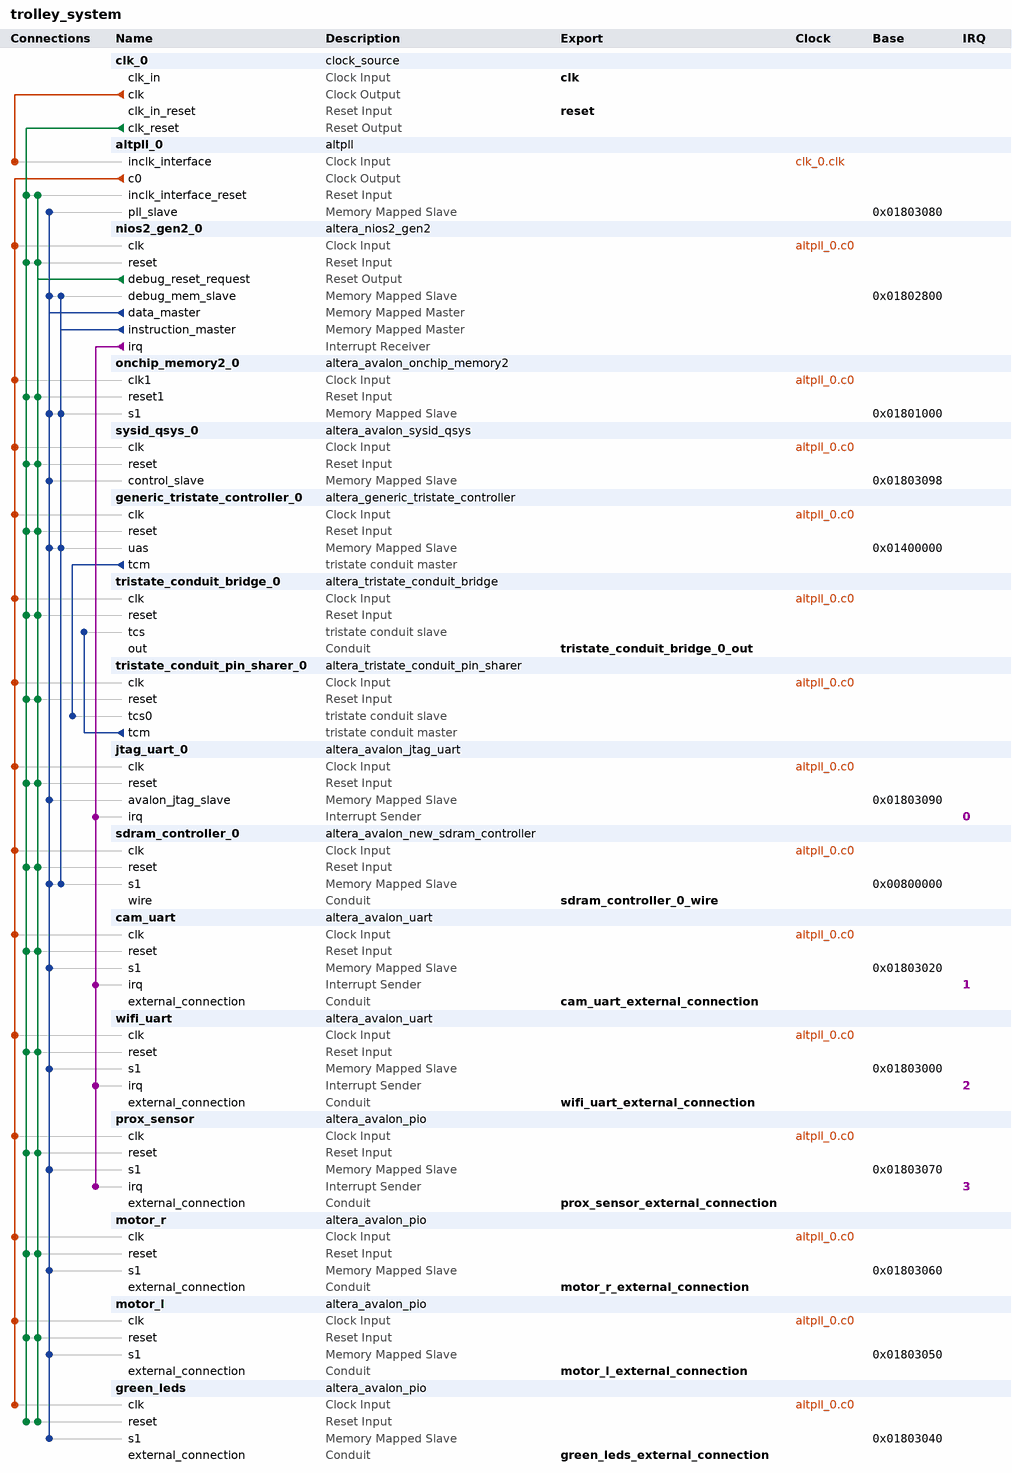
[diagram p0: system contents]
# Platform Designer (Qsys) system trolley_system, Cyclone IV E EP4CE22F17C6
# Parameters at their usual value, and those the tool derives, are not listed.
package require -exact qsys 16.1
create_system trolley_system
set_project_property DEVICE_FAMILY {Cyclone IV E}
set_project_property DEVICE EP4CE22F17C6

add_instance clk_0 clock_source 16.1
set_instance_parameter_value clk_0 clockFrequency 50000000

add_instance altpll_0 altpll 16.1
set_instance_parameter_value altpll_0 CLK0_DIVIDE_BY 1
set_instance_parameter_value altpll_0 CLK0_MULTIPLY_BY 1
set_instance_parameter_value altpll_0 INCLK0_INPUT_FREQUENCY 20000
set_instance_parameter_value altpll_0 PORT_ARESET PORT_UNUSED
set_instance_parameter_value altpll_0 PORT_LOCKED PORT_UNUSED
set_instance_parameter_value altpll_0 PORT_clk1 PORT_UNUSED
set_instance_parameter_value altpll_0 PORT_clk2 PORT_UNUSED
set_instance_parameter_value altpll_0 PORT_clk3 PORT_UNUSED

add_instance nios2_gen2_0 altera_nios2_gen2 16.1
set_instance_parameter_value nios2_gen2_0 dcache_size 2048
set_instance_parameter_value nios2_gen2_0 exceptionSlave onchip_memory2_0.s1
set_instance_parameter_value nios2_gen2_0 icache_size 4096
set_instance_parameter_value nios2_gen2_0 impl Tiny
set_instance_parameter_value nios2_gen2_0 resetSlave generic_tristate_controller_0.uas

add_instance onchip_memory2_0 altera_avalon_onchip_memory2 16.1
set_instance_parameter_value onchip_memory2_0 dataWidth 32
set_instance_parameter_value onchip_memory2_0 dualPort false
set_instance_parameter_value onchip_memory2_0 initMemContent true
set_instance_parameter_value onchip_memory2_0 initializationFileName onchip_mem.hex
set_instance_parameter_value onchip_memory2_0 memorySize 4096

add_instance sysid_qsys_0 altera_avalon_sysid_qsys 16.1
set_instance_parameter_value sysid_qsys_0 id 0

add_instance generic_tristate_controller_0 altera_generic_tristate_controller 16.1
set_instance_parameter_value generic_tristate_controller_0 ACTIVE_LOW_BEGINTRANSFER 0
set_instance_parameter_value generic_tristate_controller_0 ACTIVE_LOW_BYTEENABLE 0
set_instance_parameter_value generic_tristate_controller_0 ACTIVE_LOW_OUTPUTENABLE 0
set_instance_parameter_value generic_tristate_controller_0 ACTIVE_LOW_READ 1
set_instance_parameter_value generic_tristate_controller_0 CHIPSELECT_THROUGH_READLATENCY 0
set_instance_parameter_value generic_tristate_controller_0 INTERFACE_ASSIGNMENT_KEYS embeddedsw.configuration.isFlash,embeddedsw.configuration.isMemoryDevice,embeddedsw.configuration.isNonVolatileStorage
set_instance_parameter_value generic_tristate_controller_0 INTERFACE_ASSIGNMENT_VALUES 1,1,1
set_instance_parameter_value generic_tristate_controller_0 MODULE_ASSIGNMENT_KEYS embeddedsw.configuration.hwClassnameDriverSupportList,embeddedsw.configuration.isFlash,embeddedsw.configuration.isMemoryDevice,embeddedsw.configuration.isNonVolatileStorage
set_instance_parameter_value generic_tristate_controller_0 MODULE_ASSIGNMENT_VALUES "altera_avalon_lan91c111\\,altera_avalon_cfi_flash,1,1,1"
set_instance_parameter_value generic_tristate_controller_0 TCM_ADDRESS_W 22
set_instance_parameter_value generic_tristate_controller_0 TCM_BYTEENABLE_W 1
set_instance_parameter_value generic_tristate_controller_0 TCM_DATA_HOLD 40
set_instance_parameter_value generic_tristate_controller_0 TCM_DATA_W 8
set_instance_parameter_value generic_tristate_controller_0 TCM_MAX_PENDING_READ_TRANSACTIONS 3
set_instance_parameter_value generic_tristate_controller_0 TCM_READLATENCY 2
set_instance_parameter_value generic_tristate_controller_0 TCM_READ_WAIT 160
set_instance_parameter_value generic_tristate_controller_0 TCM_SETUP_WAIT 40
set_instance_parameter_value generic_tristate_controller_0 TCM_SYMBOLS_PER_WORD 1
set_instance_parameter_value generic_tristate_controller_0 TCM_TIMING_UNITS 0
set_instance_parameter_value generic_tristate_controller_0 TCM_TURNAROUND_TIME 2
set_instance_parameter_value generic_tristate_controller_0 TCM_WRITE_WAIT 160
set_instance_parameter_value generic_tristate_controller_0 USE_BEGINTRANSFER 0
set_instance_parameter_value generic_tristate_controller_0 USE_BYTEENABLE 0
set_instance_parameter_value generic_tristate_controller_0 USE_OUTPUTENABLE 0
set_instance_parameter_value generic_tristate_controller_0 USE_READ 1

add_instance tristate_conduit_bridge_0 altera_tristate_conduit_bridge 16.1

add_instance tristate_conduit_pin_sharer_0 altera_tristate_conduit_pin_sharer 16.1
set_instance_parameter_value tristate_conduit_pin_sharer_0 MODULE_ORIGIN_LIST generic_tristate_controller_0.tcm,generic_tristate_controller_0.tcm,generic_tristate_controller_0.tcm,generic_tristate_controller_0.tcm,generic_tristate_controller_0.tcm
set_instance_parameter_value tristate_conduit_pin_sharer_0 NUM_INTERFACES 1
set_instance_parameter_value tristate_conduit_pin_sharer_0 SHARED_SIGNAL_LIST ,

add_instance jtag_uart_0 altera_avalon_jtag_uart 16.1
set_instance_parameter_value jtag_uart_0 simInteractiveOptions NO_INTERACTIVE_WINDOWS

add_instance sdram_controller_0 altera_avalon_new_sdram_controller 16.1
set_instance_parameter_value sdram_controller_0 TAC 5.5
set_instance_parameter_value sdram_controller_0 TRCD 20.0
set_instance_parameter_value sdram_controller_0 TRP 20.0
set_instance_parameter_value sdram_controller_0 casLatency 3
set_instance_parameter_value sdram_controller_0 columnWidth 8
set_instance_parameter_value sdram_controller_0 dataWidth 16
set_instance_parameter_value sdram_controller_0 generateSimulationModel false
set_instance_parameter_value sdram_controller_0 model single_Micron_MT48LC4M32B2_7_chip
set_instance_parameter_value sdram_controller_0 numberOfBanks 4
set_instance_parameter_value sdram_controller_0 numberOfChipSelects 1
set_instance_parameter_value sdram_controller_0 powerUpDelay 100.0
set_instance_parameter_value sdram_controller_0 refreshPeriod 15.625
set_instance_parameter_value sdram_controller_0 rowWidth 12

add_instance cam_uart altera_avalon_uart 16.1
set_instance_parameter_value cam_uart baud 38400
set_instance_parameter_value cam_uart dataBits 8
set_instance_parameter_value cam_uart fixedBaud true
set_instance_parameter_value cam_uart parity NONE
set_instance_parameter_value cam_uart stopBits 1

add_instance wifi_uart altera_avalon_uart 16.1
set_instance_parameter_value wifi_uart baud 57600
set_instance_parameter_value wifi_uart dataBits 8
set_instance_parameter_value wifi_uart fixedBaud true
set_instance_parameter_value wifi_uart parity NONE
set_instance_parameter_value wifi_uart stopBits 1

add_instance prox_sensor altera_avalon_pio 16.1
set_instance_parameter_value prox_sensor direction Input
set_instance_parameter_value prox_sensor generateIRQ true
set_instance_parameter_value prox_sensor width 1

add_instance motor_r altera_avalon_pio 16.1
set_instance_parameter_value motor_r direction Output
set_instance_parameter_value motor_r width 3

add_instance motor_l altera_avalon_pio 16.1
set_instance_parameter_value motor_l direction Output
set_instance_parameter_value motor_l width 3

add_instance green_leds altera_avalon_pio 16.1
set_instance_parameter_value green_leds direction Output
set_instance_parameter_value green_leds width 8

# connections
add_connection altpll_0.c0 cam_uart.clk clock
add_connection altpll_0.c0 generic_tristate_controller_0.clk clock
add_connection altpll_0.c0 green_leds.clk clock
add_connection altpll_0.c0 jtag_uart_0.clk clock
add_connection altpll_0.c0 motor_l.clk clock
add_connection altpll_0.c0 motor_r.clk clock
add_connection altpll_0.c0 nios2_gen2_0.clk clock
add_connection altpll_0.c0 onchip_memory2_0.clk1 clock
add_connection altpll_0.c0 prox_sensor.clk clock
add_connection altpll_0.c0 sdram_controller_0.clk clock
add_connection altpll_0.c0 sysid_qsys_0.clk clock
add_connection altpll_0.c0 tristate_conduit_bridge_0.clk clock
add_connection altpll_0.c0 tristate_conduit_pin_sharer_0.clk clock
add_connection altpll_0.c0 wifi_uart.clk clock
add_connection clk_0.clk altpll_0.inclk_interface clock
add_connection clk_0.clk_reset altpll_0.inclk_interface_reset reset
add_connection clk_0.clk_reset cam_uart.reset reset
add_connection clk_0.clk_reset generic_tristate_controller_0.reset reset
add_connection clk_0.clk_reset green_leds.reset reset
add_connection clk_0.clk_reset jtag_uart_0.reset reset
add_connection clk_0.clk_reset motor_l.reset reset
add_connection clk_0.clk_reset motor_r.reset reset
add_connection clk_0.clk_reset nios2_gen2_0.reset reset
add_connection clk_0.clk_reset onchip_memory2_0.reset1 reset
add_connection clk_0.clk_reset prox_sensor.reset reset
add_connection clk_0.clk_reset sdram_controller_0.reset reset
add_connection clk_0.clk_reset sysid_qsys_0.reset reset
add_connection clk_0.clk_reset tristate_conduit_bridge_0.reset reset
add_connection clk_0.clk_reset tristate_conduit_pin_sharer_0.reset reset
add_connection clk_0.clk_reset wifi_uart.reset reset
add_connection nios2_gen2_0.debug_reset_request altpll_0.inclk_interface_reset reset
add_connection nios2_gen2_0.debug_reset_request cam_uart.reset reset
add_connection nios2_gen2_0.debug_reset_request generic_tristate_controller_0.reset reset
add_connection nios2_gen2_0.debug_reset_request green_leds.reset reset
add_connection nios2_gen2_0.debug_reset_request jtag_uart_0.reset reset
add_connection nios2_gen2_0.debug_reset_request motor_l.reset reset
add_connection nios2_gen2_0.debug_reset_request motor_r.reset reset
add_connection nios2_gen2_0.debug_reset_request nios2_gen2_0.reset reset
add_connection nios2_gen2_0.debug_reset_request onchip_memory2_0.reset1 reset
add_connection nios2_gen2_0.debug_reset_request prox_sensor.reset reset
add_connection nios2_gen2_0.debug_reset_request sdram_controller_0.reset reset
add_connection nios2_gen2_0.debug_reset_request sysid_qsys_0.reset reset
add_connection nios2_gen2_0.debug_reset_request tristate_conduit_bridge_0.reset reset
add_connection nios2_gen2_0.debug_reset_request tristate_conduit_pin_sharer_0.reset reset
add_connection nios2_gen2_0.debug_reset_request wifi_uart.reset reset
add_connection nios2_gen2_0.data_master altpll_0.pll_slave avalon
set_connection_parameter_value nios2_gen2_0.data_master/altpll_0.pll_slave baseAddress 0x01803080
add_connection nios2_gen2_0.data_master cam_uart.s1 avalon
set_connection_parameter_value nios2_gen2_0.data_master/cam_uart.s1 baseAddress 0x01803020
add_connection nios2_gen2_0.data_master generic_tristate_controller_0.uas avalon
set_connection_parameter_value nios2_gen2_0.data_master/generic_tristate_controller_0.uas baseAddress 0x01400000
add_connection nios2_gen2_0.data_master green_leds.s1 avalon
set_connection_parameter_value nios2_gen2_0.data_master/green_leds.s1 baseAddress 0x01803040
add_connection nios2_gen2_0.data_master jtag_uart_0.avalon_jtag_slave avalon
set_connection_parameter_value nios2_gen2_0.data_master/jtag_uart_0.avalon_jtag_slave baseAddress 0x01803090
add_connection nios2_gen2_0.data_master motor_l.s1 avalon
set_connection_parameter_value nios2_gen2_0.data_master/motor_l.s1 baseAddress 0x01803050
add_connection nios2_gen2_0.data_master motor_r.s1 avalon
set_connection_parameter_value nios2_gen2_0.data_master/motor_r.s1 baseAddress 0x01803060
add_connection nios2_gen2_0.data_master nios2_gen2_0.debug_mem_slave avalon
set_connection_parameter_value nios2_gen2_0.data_master/nios2_gen2_0.debug_mem_slave baseAddress 0x01802800
add_connection nios2_gen2_0.data_master onchip_memory2_0.s1 avalon
set_connection_parameter_value nios2_gen2_0.data_master/onchip_memory2_0.s1 baseAddress 0x01801000
add_connection nios2_gen2_0.data_master prox_sensor.s1 avalon
set_connection_parameter_value nios2_gen2_0.data_master/prox_sensor.s1 baseAddress 0x01803070
add_connection nios2_gen2_0.data_master sdram_controller_0.s1 avalon
set_connection_parameter_value nios2_gen2_0.data_master/sdram_controller_0.s1 baseAddress 0x00800000
add_connection nios2_gen2_0.data_master sysid_qsys_0.control_slave avalon
set_connection_parameter_value nios2_gen2_0.data_master/sysid_qsys_0.control_slave baseAddress 0x01803098
add_connection nios2_gen2_0.data_master wifi_uart.s1 avalon
set_connection_parameter_value nios2_gen2_0.data_master/wifi_uart.s1 baseAddress 0x01803000
add_connection nios2_gen2_0.instruction_master generic_tristate_controller_0.uas avalon
set_connection_parameter_value nios2_gen2_0.instruction_master/generic_tristate_controller_0.uas baseAddress 0x01400000
add_connection nios2_gen2_0.instruction_master nios2_gen2_0.debug_mem_slave avalon
set_connection_parameter_value nios2_gen2_0.instruction_master/nios2_gen2_0.debug_mem_slave baseAddress 0x01802800
add_connection nios2_gen2_0.instruction_master onchip_memory2_0.s1 avalon
set_connection_parameter_value nios2_gen2_0.instruction_master/onchip_memory2_0.s1 baseAddress 0x01801000
add_connection nios2_gen2_0.instruction_master sdram_controller_0.s1 avalon
set_connection_parameter_value nios2_gen2_0.instruction_master/sdram_controller_0.s1 baseAddress 0x00800000
add_connection nios2_gen2_0.irq cam_uart.irq interrupt
set_connection_parameter_value nios2_gen2_0.irq/cam_uart.irq irqNumber 1
add_connection nios2_gen2_0.irq jtag_uart_0.irq interrupt
set_connection_parameter_value nios2_gen2_0.irq/jtag_uart_0.irq irqNumber 0
add_connection nios2_gen2_0.irq prox_sensor.irq interrupt
set_connection_parameter_value nios2_gen2_0.irq/prox_sensor.irq irqNumber 3
add_connection nios2_gen2_0.irq wifi_uart.irq interrupt
set_connection_parameter_value nios2_gen2_0.irq/wifi_uart.irq irqNumber 2
add_connection generic_tristate_controller_0.tcm tristate_conduit_pin_sharer_0.tcs0 tristate_conduit
add_connection tristate_conduit_pin_sharer_0.tcm tristate_conduit_bridge_0.tcs tristate_conduit

# exported interfaces
add_interface cam_uart_external_connection conduit end
set_interface_property cam_uart_external_connection EXPORT_OF cam_uart.external_connection
add_interface clk clock sink
set_interface_property clk EXPORT_OF clk_0.clk_in
add_interface green_leds_external_connection conduit end
set_interface_property green_leds_external_connection EXPORT_OF green_leds.external_connection
add_interface motor_l_external_connection conduit end
set_interface_property motor_l_external_connection EXPORT_OF motor_l.external_connection
add_interface motor_r_external_connection conduit end
set_interface_property motor_r_external_connection EXPORT_OF motor_r.external_connection
add_interface prox_sensor_external_connection conduit end
set_interface_property prox_sensor_external_connection EXPORT_OF prox_sensor.external_connection
add_interface reset reset sink
set_interface_property reset EXPORT_OF clk_0.clk_in_reset
add_interface sdram_controller_0_wire conduit end
set_interface_property sdram_controller_0_wire EXPORT_OF sdram_controller_0.wire
add_interface tristate_conduit_bridge_0_out conduit end
set_interface_property tristate_conduit_bridge_0_out EXPORT_OF tristate_conduit_bridge_0.out
add_interface wifi_uart_external_connection conduit end
set_interface_property wifi_uart_external_connection EXPORT_OF wifi_uart.external_connection

set_interconnect_requirement {$system} qsys_mm.clockCrossingAdapter HANDSHAKE
set_interconnect_requirement {$system} qsys_mm.enableEccProtection FALSE
set_interconnect_requirement {$system} qsys_mm.insertDefaultSlave FALSE
set_interconnect_requirement {$system} qsys_mm.maxAdditionalLatency 1

save_system trolley_system.qsys
